# EAGLE schematic powersupplyboard 2 (EAGLE 9.6.2)
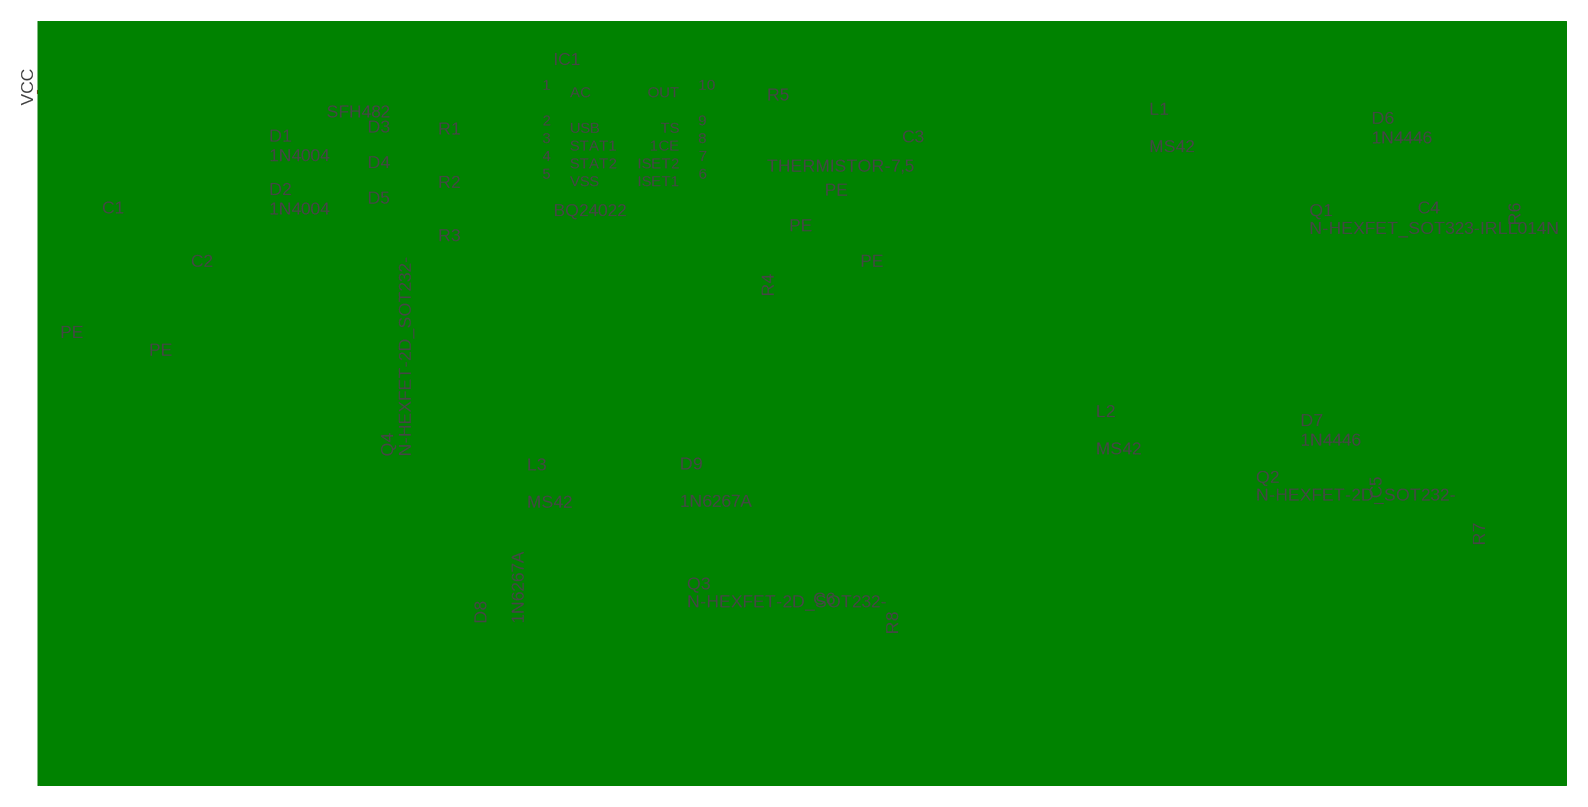
[diagram p0: schematic, sheet 1]

## Parts
C1  C2.5/2  [C2.5-2]
C2  C2.5/2  [C2.5-2]
C3  C2.5/2  [C2.5-2]
C4  C2.5/2  [C2.5-2]
C5  C2.5/2  [C2.5-2]
C6  C2.5/2  [C2.5-2]
D1  1N4004  [DO41-10]
D2  1N4004  [DO41-10]
D3  SFH482  [SFH482]
D4  SFH482  [SFH482]
D5  SFH482  [SFH482]
D6  1N4446  [DO35-10]
D7  1N4446  [DO35-10]
D8  1N6267A  [C4111-15]
D9  1N6267A  [C4111-15]
IC1  BQ24022  [DRC-S-PVSON-N10]
L1  MS42  [MS42]
L2  MS42  [MS42]
L3  MS42  [MS42]
Q1  N-HEXFET_SOT323-IRLL014N  [SOT223]
Q2  N-HEXFET-2D_SOT232-  [SOT223]
Q3  N-HEXFET-2D_SOT232-  [SOT223]
Q4  N-HEXFET-2D_SOT232-  [SOT223]
R1  R-EU_0204/7  [0204/7]
R2  R-EU_0204/7  [0204/7]
R3  R-EU_0204/7  [0204/7]
R4  R-EU_0204/7  [0204/7]
R5  THERMISTOR-7,5  [R-7,5]
R6  R-EU_0204/7  [0204/7]
R7  R-EU_0204/7  [0204/7]
R8  R-EU_0204/7  [0204/7]

## Nets
0: R4.1 ; supply symbol labelled GND
N$1: IC1.3(STAT1) R1.2
N$2: IC1.4(STAT2) R2.2
N$3: IC1.5(VSS) R3.2
N$4: D3.A D5.A
N$5: D1.C D2.C D4.A
N$6: D3.K(C) R1.1
N$7: D4.K(C) R2.1
N$8: D5.K(C) R3.1
N$9: D7.A L2.2 Q2.2(D) Q2.4(D)
N$10: D6.A L1.2 Q1.4(D)
N$11: C3.1 IC1.10(OUT)
N$12: IC1.6(ISET1) R4.2
N$13: IC1.9(TS) R5.2
N$14: C5.1 D7.C R7.2
N$15: C4.1 D6.C R6.2
N$16: D8.C L3.1 Q4.3(S)
N$17: D9.A L3.2 Q3.2(D) Q3.4(D)
N$18: D9.C
N$19: C6.1
N$20: R8.2
N$22: C2.1 D1.A
N$23: Q3.1(G) Q4.1(G)
PE: C1.2 C2.2 C3.2 IC1.8(1CE) R5.1
VCC: C1.1 C6.2 D2.A D8.A IC1.1(AC) Q3.3(S) Q4.2(D) Q4.4(D) R8.1
VSS: C4.2 C5.2 L1.1 L2.1 Q1.3(S) Q2.3(S) R6.1 R7.1
Unconnected: IC1.2(USB) IC1.7(ISET2) IC1.TH Q1.1(G) Q2.1(G)

## Notes on the sheet
- POWER SOURCE
- BOOST CONVERTER
- BOOST CONVERTER
- POWER SOURCE
- CONTROL UNIT
- (Oscillator,
- PWM & Control)
- BOOST CONVERTER
- BOOST CONVERTER
- BUCK-BOOST CONVERTER | BUCK-BOOST CONVERTER

## Library data of the parts
C1-C6 = capacitor-wima:C: CAPACITOR naming: grid - package width
D1 D2 = diode:1N4004: DIODE general purpose rectifier, 1 A
D3-D5 = led:SFH482: IR LED infrared emitting diode, Infineon
D6 D7 = diode:1N4446: DIODE high speed (Philips)
D8 D9 = diode:1N6267A: DIODE transient voltage suppressor
IC1 = texas:BQ24022: SINGLE-CHIP, LI-ION AND LI-POL CHARGER IC WITH AUTONOMOUS USB-PORT AND AC-ADAPTER SUPPLY MANAGEMENT (bqTINY™-II) Source: bq24022.pdf (www.ti.com)
L1-L3 = inductor-neosid:MS42: INDUCTOR SMD inductor; OC_FARNELL: unknown; OC_NEWARK: unknown
Q1 = transistor-power:N-HEXFET_?-*: HEXFET® Power MOSFET
Q2-Q4 = transistor-power:N-HEXFET-2D_?-*: HEXFET® Power MOSFET 2 Drain connects http://www.irf.com/product-info/datasheets/data/irll014n.pdf
R1-R4 R6-R8 = rcl:R-EU_: RESISTOR, European symbol; SPICEPREFIX: R
R5 = varistor:THERMISTOR: THERMISTOR